# EAGLE design Old Shutters Signal Interface - SiLabs (EAGLE 9.0.1)
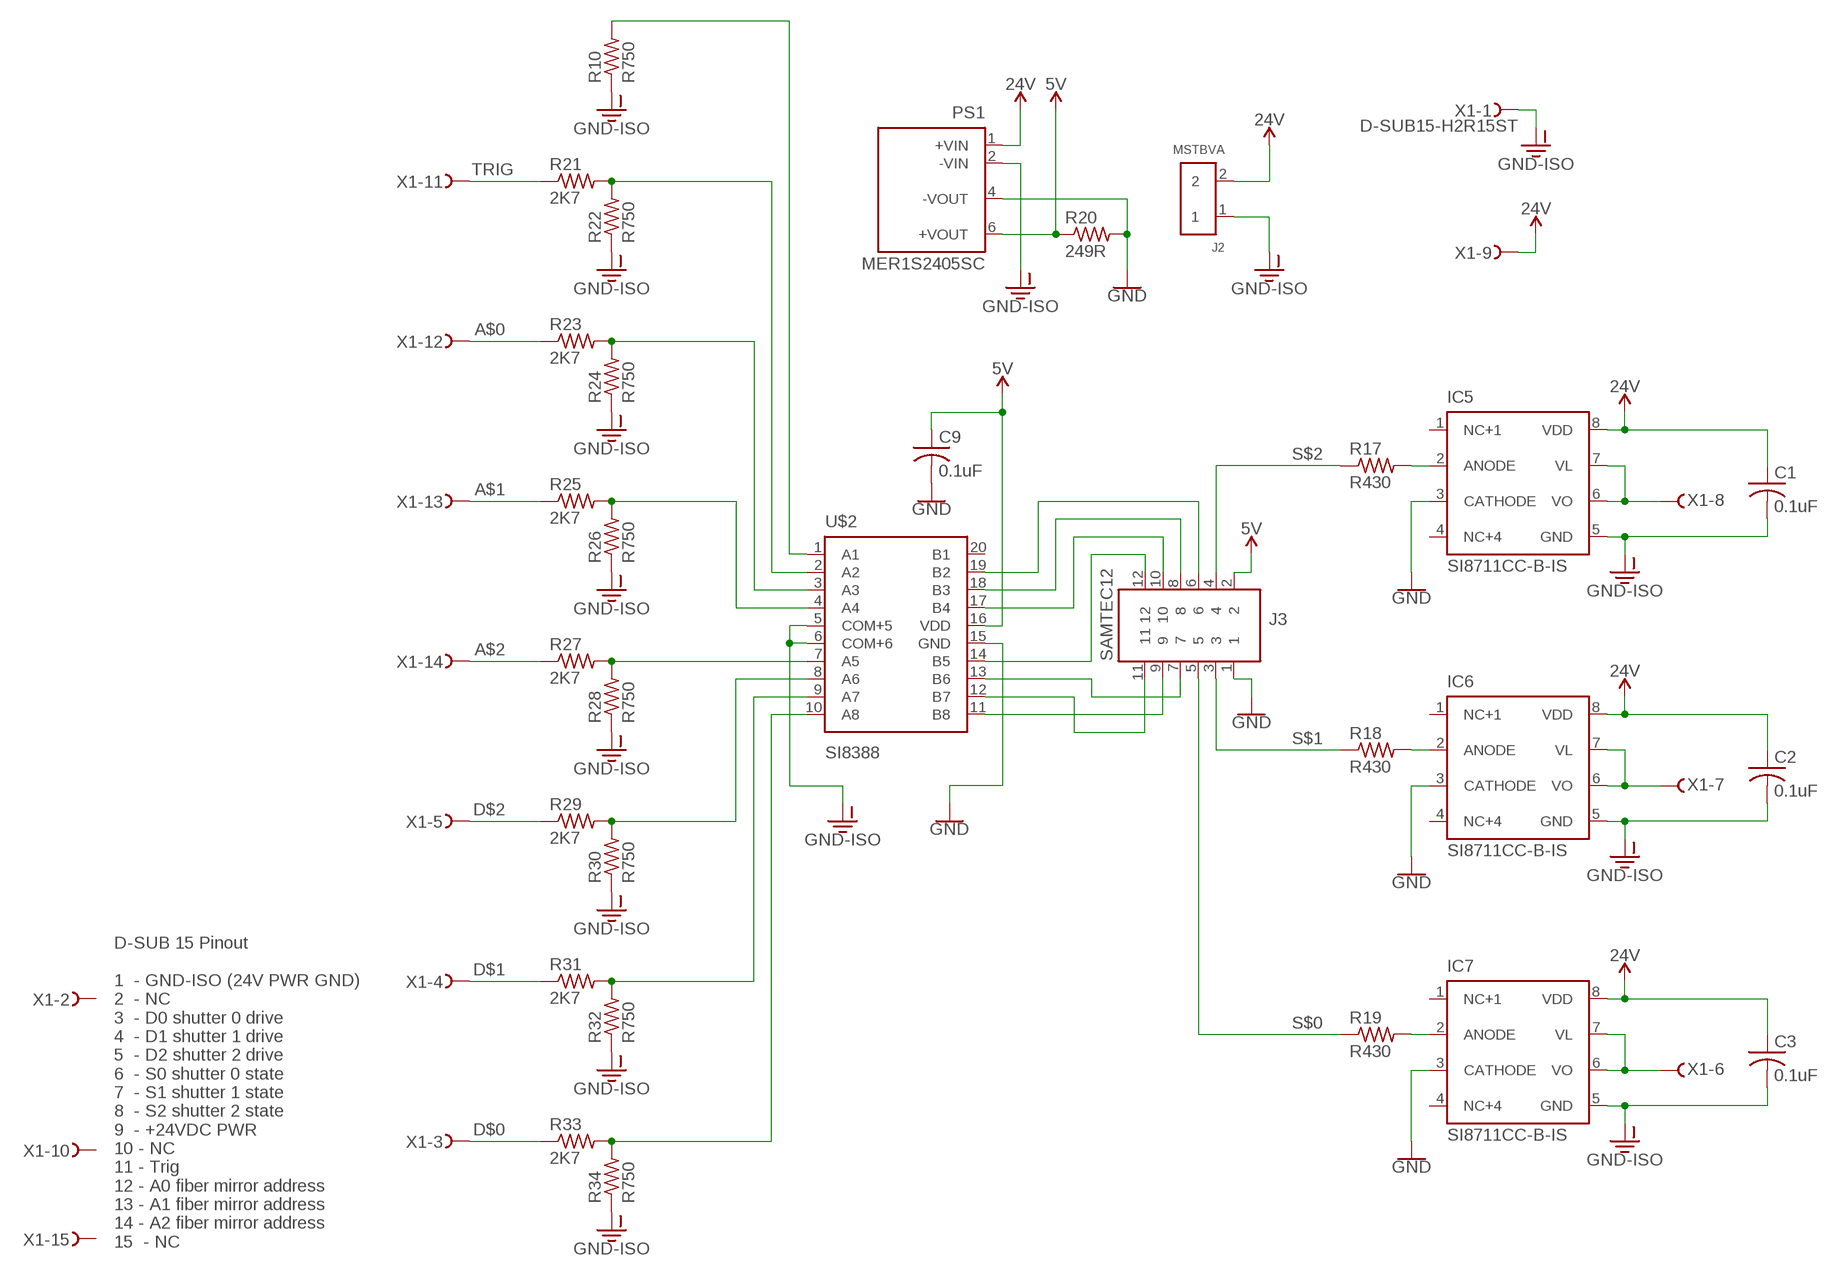
[diagram p0: schematic, sheet 1]

## Parts
C1  0.1uF  C-USC0805  [C0805]
C2  0.1uF  C-USC0805  [C0805]
C3  0.1uF  C-USC0805  [C0805]
C9  0.1uF  C-USC0805  [C0805]
IC5  SI8711CC-B-IS  [SO08]
IC6  SI8711CC-B-IS  [SO08]
IC7  SI8711CC-B-IS  [SO08]
J2  MSTBVA  [MSTBVA]
J3  SAMTEC12  [SAMTEC12]
PS1  MER1S2405SC  MER1  [MER1]
R10  R750  R-US_R0805  [R0805]
R17  R430  R-US_R0805  [R0805]
R18  R430  R-US_R0805  [R0805]
R19  R430  R-US_R0805  [R0805]
R20  249R  R-US_R0805  [R0805]
R21  2K7  R-US_R0805  [R0805]
R22  R750  R-US_R0805  [R0805]
R23  2K7  R-US_R0805  [R0805]
R24  R750  R-US_R0805  [R0805]
R25  2K7  R-US_R0805  [R0805]
R26  R750  R-US_R0805  [R0805]
R27  2K7  R-US_R0805  [R0805]
R28  R750  R-US_R0805  [R0805]
R29  2K7  R-US_R0805  [R0805]
R30  R750  R-US_R0805  [R0805]
R31  2K7  R-US_R0805  [R0805]
R32  R750  R-US_R0805  [R0805]
R33  2K7  R-US_R0805  [R0805]
R34  R750  R-US_R0805  [R0805]
U$2  SI8388  [20-QSOP]
X1  D-SUB15-H2R15ST  [H2R15ST]

## Nets
5V: C9.1 J3.2 PS1.6(+VOUT) R20.1 U$2.16(VDD)
24V [pwr]: C1.1 C2.1 C3.1 IC5.8(VDD) IC6.8(VDD) IC7.8(VDD) J2.2 PS1.1(+VIN) X1.9
A$0: R23.1 X1.12
A$1: R25.1 X1.13
A$2: R27.1 X1.14
D$0: R33.1 X1.3
D$1: R31.1 X1.4
D$2: R29.1 X1.5
GND: C9.2 IC5.3(CATHODE) IC6.3(CATHODE) IC7.3(CATHODE) J3.1 PS1.4(-VOUT) R20.2 U$2.15(GND)
GND-ISO [pwr]: C1.2 C2.2 C3.2 IC5.5(GND) IC6.5(GND) IC7.5(GND) J2.1 PS1.2(-VIN) R10.1 R22.1 R24.1 R26.1 R28.1 R30.1 R32.1 R34.1 U$2.5(COM+5) U$2.6(COM+6) X1.1
N$1: IC5.2(ANODE) R17.2
N$2: R10.2 U$2.1(A1)
N$3: IC7.6(VO) IC7.7(VL) X1.6
N$4: R21.2 R22.2 U$2.2(A2)
N$5: J3.6 U$2.19(B2)
N$6: J3.8 U$2.18(B3)
N$7: R23.2 R24.2 U$2.3(A3)
N$8: J3.10 U$2.17(B4)
N$9: J3.12 U$2.14(B5)
N$10: J3.7 U$2.13(B6)
N$11: J3.11 U$2.12(B7)
N$12: J3.9 U$2.11(B8)
N$14: R25.2 R26.2 U$2.4(A4)
N$16: R27.2 R28.2 U$2.7(A5)
N$18: R29.2 R30.2 U$2.8(A6)
N$19: IC6.6(VO) IC6.7(VL) X1.7
N$20: IC5.6(VO) IC5.7(VL) X1.8
N$21: R31.2 R32.2 U$2.9(A7)
N$22: R33.2 R34.2 U$2.10(A8)
N$34: IC6.2(ANODE) R18.2
N$36: IC7.2(ANODE) R19.2
S$0: J3.5 R19.1
S$1: J3.3 R18.1
S$2: J3.4 R17.1
TRIG: R21.1 X1.11
Unconnected: IC5.1(NC+1) IC5.4(NC+4) IC6.1(NC+1) IC6.4(NC+4) IC7.1(NC+1) IC7.4(NC+4) U$2.20(B1) X1.2 X1.10 X1.15

## Notes on the sheet
- D-SUB 15 Pinout
  
  1  - GND-ISO (24V PWR GND)
  2  - NC
  3  - D0 shutter 0 drive
  4  - D1 shutter 1 drive
  5  - D2 shutter 2 drive
  6  - S0 shutter 0 state
  7  - S1 shutter 1 state
  8  - S2 shutter 2 state 
  9  - +24VDC PWR
  10 - NC
  11 - Trig
  12 - A0 fiber mirror address
  13 - A1 fiber mirror address
  14 - A2 fiber mirror address
  15  - NC

## Library data of the parts
C1-C3 C9 = rcl:C-US: CAPACITOR, American symbol; SPICEPREFIX: C
IC5-IC7 = AU:SI8711CC-B-IS: Si8711CC-B-IS Optocoupler emulator, open collector output, integrated 20K pullup Digikey 336-2385-ND, $0.79 each
J2 = AU:MSTBVA: Phoenix Contact MSTBVA Vertical Terminal Block Phoenix order number 1755736 Digikey: 277-1150-ND Mating part is Phoneix Contact Combicon Spring Cage plug TFCK 5.08 mm pitch Digikey: 277-6941-ND
J3 = AU:SAMTEC12
PS1 = AU:MER1
R10 R17-R34 = rcl:R-US_: RESISTOR, American symbol; SPICEPREFIX: R
U$2 = AU:SI8388: Si8388 Silicon Labs Digital Input 8-port 24V to 5V with isolation
X1 = con-thomas-betts:D-SUB15-: D-Subminiatur Connector Source: Electronioc Interconnects European Edition 1998; OC_FARNELL: unknown; OC_NEWARK: unknown

## Net classes
1 pwr: width 0.254 mm, clearance 0.254 mm

## Board
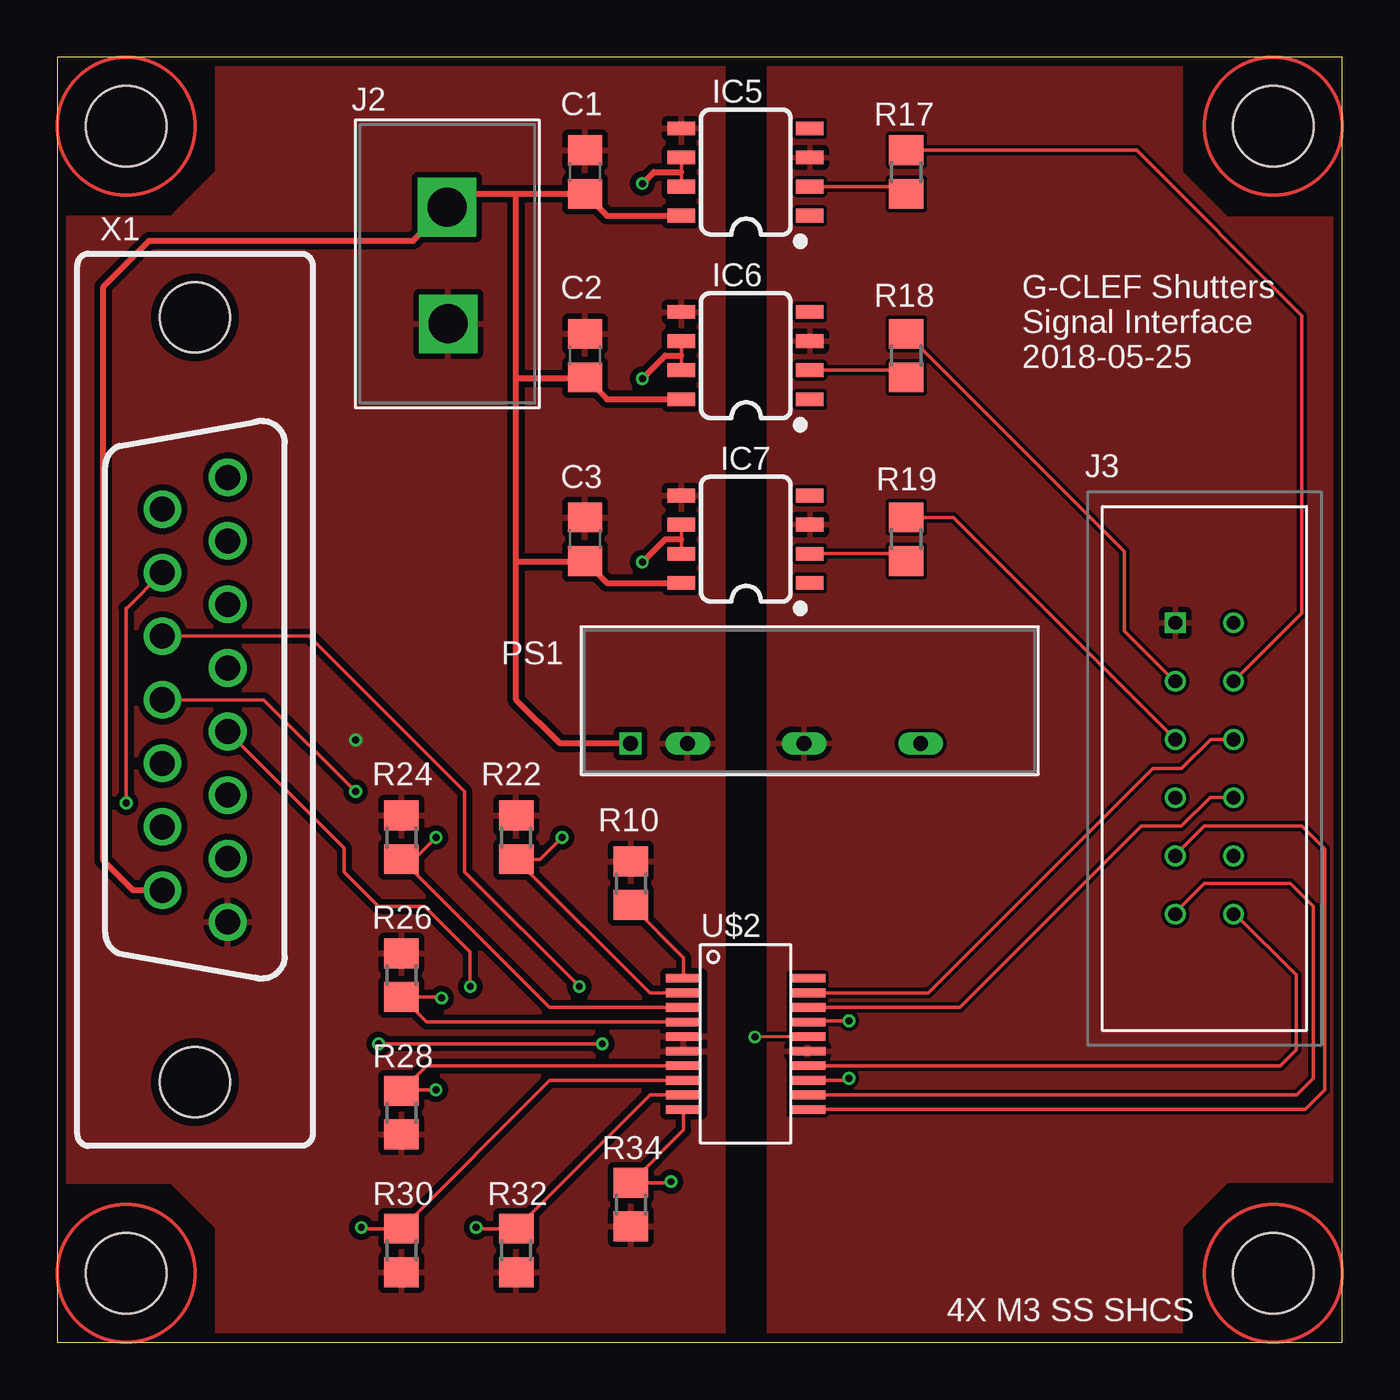
[diagram p1: board, top side]
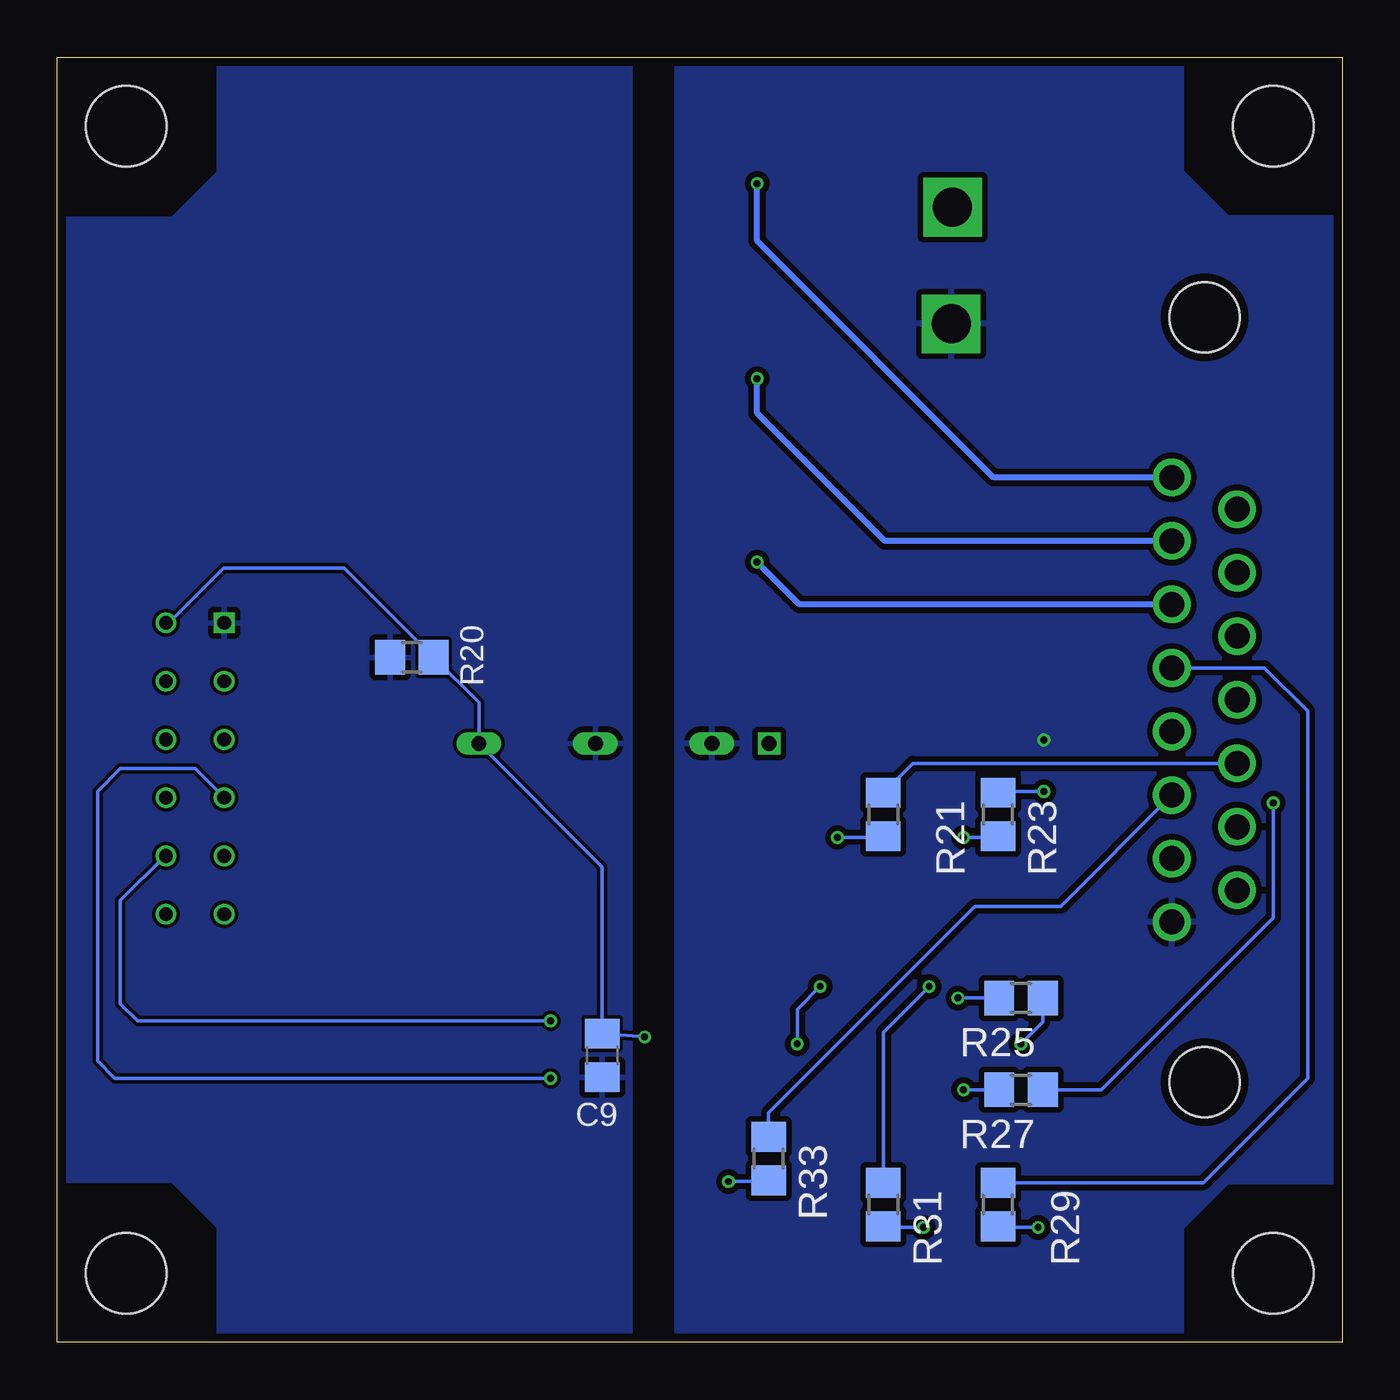
[diagram p2: board, bottom side, seen from below]

Size 56 x 56 mm. Coordinates in mm from the lower left corner, seen from the top.
Outline: 0,0 56,0 56,56 0,56 0,0
Copper layers (1*16): Top 0.035559375mm / dielectric 1.6mm / Bottom 0.035559375mm
Design rules "oshpark-2layer": minimum track width 6mil, minimum drill 10mil, track to track 6mil, track to pad 6mil, pad to pad 6mil, via to via 6mil, smd to smd 6mil, copper to edge 15mil, drill to drill 6mil, minimum pad ring 5mil, minimum via ring 5mil, stop-mask expansion 2.5mil, vias tented up to drill 0mil, thermal gap 10mil
Holes 3.5 mm at 3,3 3,53 53,53 53,3

### Footprints (pad centres in the part's own frame; a part is rotated, then mirrored left to right if it is on the bottom)
C0805 = smd 1.3 x 1.5: 1 -0.95,0; 2 0.95,0
SO08 = smd 0.6 x 1.2: 1 -1.905,-2.8; 2 -0.635,-2.8; 3 0.635,-2.8; 4 1.905,-2.8; 5 1.905,2.8; 6 0.635,2.8; 7 -0.635,2.8; 8 -1.905,2.8
MSTBVA = drill 1.7 square: 1 -2.61,-0.04; 2 2.47,0.02
SAMTEC12 = drill 0.6 square: 1 -1.27,6.35 | drill 0.6: 2 1.27,6.35; 3 -1.27,3.81; 4 1.27,3.81; 5 -1.27,1.27; 6 1.27,1.27; 7 -1.27,-1.27; 8 1.27,-1.27; 9 -1.27,-3.81; 10 1.27,-3.81; 11 -1.27,-6.35; 12 1.27,-6.35
MER1 = drill 0.65 square: 1 -7.62,-1.905 | drill 0.65 long: 2 -5.131,-1.905; 4 -0.051,-1.905; 6 5.029,-1.905
R0805 = smd 1.3 x 1.5: 1 -0.95,0; 2 0.95,0
20-QSOP = smd 1.55 x 0.38: 1 -2.7,2.86; 2 -2.7,2.22; 3 -2.7,1.59; 4 -2.7,0.95; 5 -2.7,0.32; 6 -2.7,-0.32; 7 -2.7,-0.95; 8 -2.7,-1.59; 9 -2.7,-2.22; 10 -2.7,-2.86; 11 2.7,-2.86; 12 2.7,-2.22; 13 2.7,-1.59; 14 2.7,-0.95; 15 2.7,-0.32; 16 2.7,0.32; 17 2.7,0.95; 18 2.7,1.59; 19 2.7,2.22; 20 2.7,2.86
H2R15ST = drill 1.092: 1 9.69,1.422; 2 6.921,1.422; 3 4.153,1.422; 4 1.384,1.422; 5 -1.384,1.422; 6 -4.153,1.422; 7 -6.921,1.422; 8 -9.69,1.422; 9 8.306,-1.422; 10 5.537,-1.422; 11 2.769,-1.422; 12 0,-1.422; 13 -2.769,-1.422; 14 -5.537,-1.422; 15 -8.306,-1.422 | hole 3.048: -16.662,0; 16.662,0

### Placement (x,y rotation side)
C1  23,51 90 top
C2  23,43 90 top
C3  23,35 90 top
C9  32.25,12.5 270 bottom
IC5  30,51 90 top
IC6  30,43 90 top
IC7  30,35 90 top
J2  17,47 90 top
J3  50,25 0 top
PS1  32.6,28 0 top
R10  25,20 270 top
R17  37,51 270 top
R18  37,43 270 top
R19  37,35 270 top
R20  40.55,29.85 180 bottom
R21  20,23 270 bottom
R22  20,22 270 top
R23  15,23 270 bottom
R24  15,22 270 top
R25  14,15 180 bottom
R26  15,16 270 top
R27  14,11 180 bottom
R28  15,10 90 top
R29  15,6 270 bottom
R30  15,4 90 top
R31  20,6 270 bottom
R32  20,4 90 top
R33  25,8 270 bottom
R34  25,6 90 top
U$2  30,13 0 top
X1  6,28 270 top

### Tracks (layer width: path | path; a pad name or v marks a point on that pad's centre or on a via)
5V  (via drill 0.3)
  Top 0.152: U$2.16 v30.4,13.3
  Bottom 0.152: J3.2 51.15,31.35 48.75,33.75 43.5,33.75 R20.1 37.63,27.88 PS1.6 32.25,20.72 C9.1 v30.4,13.3
24V
  Top 0.254: 20,50.05 17.56,50.05 J2.2 15.51,48 4,48 2,46 2,21 3.31,19.69 X1.9 | 20,50.05 C1.1 23.95,49.09 IC5.8 | PS1.1 21.91,26.09 20,28 20,34 | 20,34 20,42 | 20,42 20,50.05 | 20,42 22.95,42 C2.1 23.95,41.09 IC6.8 | 20,34 22.95,34 C3.1 23.95,33.09 IC7.8
A$0  (via drill 0.3)
  Top 0.152: v13,24 9,28 X1.12
  Bottom 0.152: R23.1 14.95,24 v13,24
A$1  (via drill 0.3)
  Top 0.152: X1.13 10.98,30.77 17.75,24 17.75,20.5 v22.75,15.5 | v23.75,13 v14,13
  Bottom 0.152: v22.75,15.5 23.75,14.5 v23.75,13 | v14,13 13.05,13.95 R25.1
A$2  (via drill 0.3)
  Top 0.152: X1.14 3.04,32 3,32 v3,23.5
  Bottom 0.152: v3,23.5 3,18.5 10.5,11 R27.1
D$0
  Bottom 0.152: X1.3 12.27,19 16,19 25,10 R33.1
D$1  (via drill 0.3)
  Top 0.152: X1.4 12.5,21.54 12.5,20.5 14,19 16,19 18,17 v18,15.5
  Bottom 0.152: v18,15.5 20,13.5 R31.1
D$2
  Bottom 0.152: R29.1 6.05,6.95 1.5,11.5 1.5,27.5 3.38,29.38 X1.5
GND
  pour Top: 31,0 49,0 49,5 51,7 56,7 56,49 51,49 49,51 49,56 31,56
  pour Bottom: 31,0 49,0 49,5 51,7 56,7 56,49 51,49 49,51 49,56 31,56
GND-ISO  (via drill 0.3)
  other vias: 13,26.25
  pour Bottom: 7,5 5,7 0,7 0,49 5,49 7,51 7,56 29,56 29,0 7,0
  pour Top: 7,5 5,7 0,7 0,49 5,49 7,51 7,56 29,56 29,0 7,0
N$1
  Top 0.152: IC5.2 36.69,50.37 R17.2
N$2
  Top 0.152: R10.2 27.3,16.75 U$2.1
N$3  (via drill 0.3)
  Top 0.152: IC7.6 27.2,35 IC7.7
  Top 0.254: v25.5,34 26.5,35 27.2,35
  Bottom 0.254: X1.6 23.65,32.15 v25.5,34
N$4  (via drill 0.3)
  Top 0.152: U$2.2 25.83,15.22 R22.2 21.05,21.05 v22,22
  Bottom 0.152: R21.2 20.05,22 v22,22
N$5
  Top 0.152: U$2.19 37.97,15.22 47.75,25 49,25 50.27,26.27 J3.6
N$6
  Top 0.152: U$2.18 39.34,14.59 47.25,22.5 49,22.5 50.25,23.75 51.25,23.75 J3.8
N$7  (via drill 0.3)
  Top 0.152: U$2.3 21.46,14.59 R24.2 15.55,21.05 v16.5,22
  Bottom 0.152: R23.2 15.05,22 v16.5,22
N$8  (via drill 0.3)
  Top 0.152: U$2.17 32.75,14 v34.5,14
  Bottom 0.152: v34.5,14 52.5,14 53.25,14.75 53.25,19.25 51.31,21.19 J3.10
N$9
  Top 0.152: U$2.14 53.3,12.05 54,12.75 54,16 51.35,18.65 J3.12
N$10  (via drill 0.3)
  Top 0.152: U$2.13 34.41,11.41 v34.5,11.5
  Bottom 0.152: v34.5,11.5 53.5,11.5 54.25,12.25 54.25,24 53.25,25 50,25 J3.7
N$11
  Top 0.152: U$2.12 54.03,10.78 54.75,11.5 54.75,19 53.75,20 50,20 48.73,18.73 J3.11
N$12
  Top 0.152: U$2.11 54.39,10.14 55.25,11 55.25,21.5 54.25,22.5 50,22.5 48.73,21.23 J3.9
N$14  (via drill 0.3)
  Top 0.152: U$2.4 16.1,13.95 R26.2 16.7,15.05 v16.75,15
  Bottom 0.152: v16.75,15 R25.2
N$16  (via drill 0.3)
  Top 0.152: R28.2 15.03,10.97 15.05,11 | 15.05,11 16.1,12.05 U$2.7 | v16.5,11 15.05,11
  Bottom 0.152: R27.2 v16.5,11
N$18  (via drill 0.3)
  Top 0.152: U$2.8 21.46,11.41 R30.2 13.3,4.95 v13.25,5
  Bottom 0.152: v13.25,5 14.95,5 R29.2
N$19  (via drill 0.3)
  Top 0.152: IC6.7 27.2,43 IC6.6
  Top 0.254: v25.5,42 26.5,43 27.2,43
  Bottom 0.254: X1.7 19.92,34.92 25.5,40.5 v25.5,42
N$20  (via drill 0.3)
  Top 0.152: IC5.6 27.2,51 IC5.7
  Top 0.254: v25.5,50.5 26,51 27.2,51
  Bottom 0.254: X1.8 15.19,37.69 25.5,48 v25.5,50.5
N$21  (via drill 0.3)
  Top 0.152: U$2.9 25.83,10.78 R32.2 18.3,4.95 v18.25,5
  Bottom 0.152: v18.25,5 19.95,5 R31.2
N$22  (via drill 0.3)
  Top 0.152: U$2.10 27.3,9.25 R34.2 26.7,6.95 v26.75,7
  Bottom 0.152: v26.75,7 25.05,7 R33.2
N$34
  Top 0.152: IC6.2 36.69,42.37 R18.2
N$36
  Top 0.152: IC7.2 36.69,34.37 R19.2
S$0
  Top 0.152: R19.1 39.05,35.95 J3.5
S$1
  Top 0.152: R18.1 46.5,34.45 46.5,31 48.69,28.81 J3.3
S$2
  Top 0.152: R17.1 47.05,51.95 54.25,44.75 54.25,31.79 J3.4
TRIG
  Bottom 0.152: R21.1 18.72,25.23 X1.11
(copper drawn outside any net)
  shapes: Top circle x4

### Text on the board
tPlace: G-CLEF Shutters / Signal Interface / 2018-05-25 | 4X M3 SS SHCS